# EAGLE design wiggle_jig (EAGLE 6.6.0)
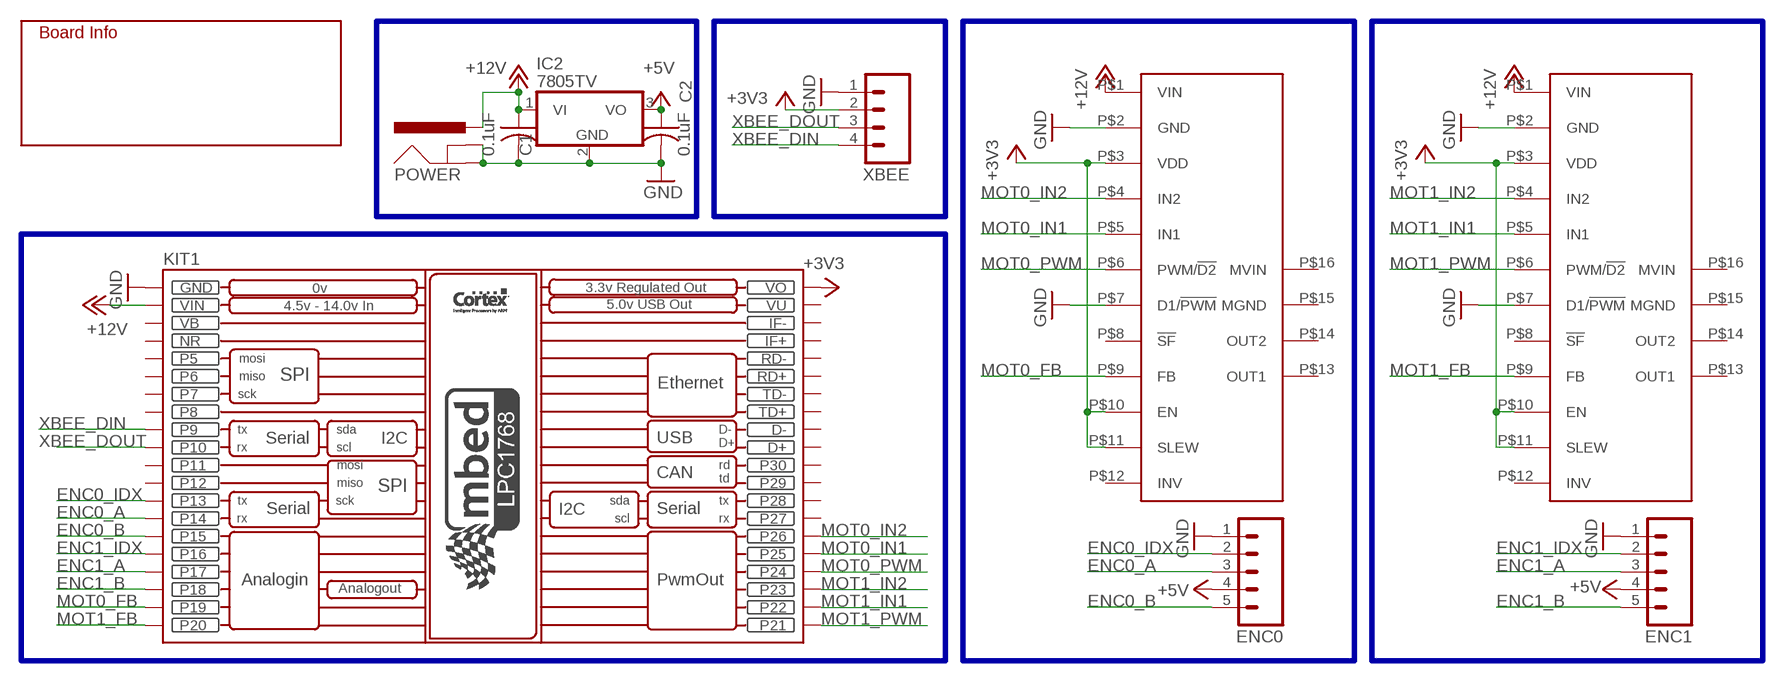
[diagram p0: schematic, sheet 1]

## Parts
C1  0.1uF  C-US025-025X050  [C025-025X050]
C2  0.1uF  C-US025-025X050  [C025-025X050]
ENC0  M05LOCK  [1X05_LOCK]
ENC1  M05LOCK  [1X05_LOCK]
IC2  7805TV  [TO220V]
KIT1  MBED_NXP_LPC1768  [MBED-KIT]
MOT0  MC33926_CARRIER  [MC33926_CARRIER]
MOT1  MC33926_CARRIER  [MC33926_CARRIER]
POWER  POWER_JACKPTH_LOCK  [POWER_JACK_PTH_LOCK]
U$4  INFO  [INFO]
XBEE  M04LOCK  [1X04_LOCK]

## Nets
+3V3: KIT1.VOUT(VO) MOT0.P$3(VDD) MOT0.P$10(EN) MOT0.P$11(SLEW) MOT1.P$3(VDD) MOT1.P$10(EN) MOT1.P$11(SLEW) XBEE.2
+5V: C2.1 ENC0.4 ENC1.4 IC2.3(VO)
+12V: C1.1 IC2.1(VI) KIT1.VIN MOT0.P$1(VIN) MOT1.P$1(VIN) POWER.PWR
ENC0_A: ENC0.3 KIT1.P$14(P14)
ENC0_B: ENC0.5 KIT1.P$15(P15)
ENC0_IDX: ENC0.2 KIT1.P$13(P13)
ENC1_A: ENC1.3 KIT1.P$17(P17)
ENC1_B: ENC1.5 KIT1.P$18(P18)
ENC1_IDX: ENC1.2 KIT1.P$16(P16)
GND: C1.2 C2.2 ENC0.1 ENC1.1 IC2.2(GND) KIT1.GND MOT0.P$2(GND) MOT0.P$7(D1/!PWM) MOT1.P$2(GND) MOT1.P$7(D1/!PWM) POWER.GND POWER.GNDBREAK XBEE.1
MOT0_FB: KIT1.P$19(P19) MOT0.P$9(FB)
MOT0_IN1: KIT1.P$25(P25) MOT0.P$5(IN1)
MOT0_IN2: KIT1.P$26(P26) MOT0.P$4(IN2)
MOT0_PWM: KIT1.P$24(P24) MOT0.P$6(PWM/!D2)
MOT1_FB: KIT1.P$20(P20) MOT1.P$9(FB)
MOT1_IN1: KIT1.P$22(P22) MOT1.P$5(IN1)
MOT1_IN2: KIT1.P$23(P23) MOT1.P$4(IN2)
MOT1_PWM: KIT1.P$21(P21) MOT1.P$6(PWM/!D2)
XBEE_DIN: KIT1.P$9(P9) XBEE.4
XBEE_DOUT: KIT1.P$10(P10) XBEE.3
Unconnected: KIT1.D+ KIT1.D- KIT1.IF+ KIT1.IF- KIT1.P$5(P5) KIT1.P$6(P6) KIT1.P$7(P7) KIT1.P$8(P8) KIT1.P$11(P11) KIT1.P$12(P12) KIT1.P$27(P27) KIT1.P$28(P28) KIT1.P$29(P29) KIT1.P$30(P30) KIT1.RD+ KIT1.RD- KIT1.TD+ KIT1.TD- MOT0.P$8(!SF) MOT0.P$12(INV) MOT0.P$13(OUT1) MOT0.P$14(OUT2) MOT0.P$15(MGND) MOT0.P$16(MVIN) MOT1.P$8(!SF) MOT1.P$12(INV) MOT1.P$13(OUT1) MOT1.P$14(OUT2) MOT1.P$15(MGND) MOT1.P$16(MVIN)

## Buses
B$1
B$2
B$3
B$4
B$5

## Power pins joined to a net without a drawn wire
NR: KIT1.NR
VB: KIT1.VB
VU: KIT1.VU

## Library data of the parts
C1 C2 = rcl:C-US: CAPACITOR, American symbol
ENC0 ENC1 = SparkFun-Connectors:M05: Header 5 Standard 5-pin 0.1" header. Use with straight break away headers (SKU : PRT-00116), right angle break away headers (PRT-00553), swiss pins (PRT-00743), machine pins (PRT-00117), and female headers (PRT-00115). Molex polarized connector foot print use with SKU : PRT-08230 with associated crimp pins and housings.
IC2 = linear:78*: Positive VOLTAGE REGULATOR Source: http://cache.national.com/ds/LM/LM78L05.pdf http://www.fairchildsemi.com/ds/LM/LM7805.pdf
KIT1 = zumy:MBED_NXP_LPC1768: Mbed LPC1768 - ARM CORTEX v2.1 * Schematic symbol is now placed in eagles's default raster. *The pads diameter are suitable for routing between mbed pins * mbed pads are 0.8 mm drill diameter. --------------------------------------------- Created by: Mohamed Yousry *Alexandria, Egypt *Email: mohamed.yousry@ieeegoldegypt.org
MOT0 MOT1 = arm:MC33926_CARRIER
POWER = SparkFun-Connectors:POWER_JACK: Power Jack This is the standard 5.5mm barrel jack for power. The PTH is the most common, proven, reliable, footprint. The Slot footprint only works if the mill layer is transmitted to the PCB fab house so be warned. Mating wall wart : TOL-00298 (and others); PROD_ID: PRT-00119
U$4 = modular_robotics:INFO; AUTHOR: A. Buchan; DATE: Oct. 19, 2016; DESIGN: WiggleJig; ORGANIZATION: Biomimetic Millisystems Lab; REVISION: r0.0
XBEE = SparkFun-Connectors:M04: Header 4 Standard 4-pin 0.1" header. Use with straight break away headers (SKU : PRT-00116), right angle break away headers (PRT-00553), swiss pins (PRT-00743), machine pins (PRT-00117), and female headers (PRT-00115). Molex polarized connector foot print use with SKU : PRT-08231 with associated crimp pins and housings. 1MM SMD Version SKU: PRT-10208

## Board
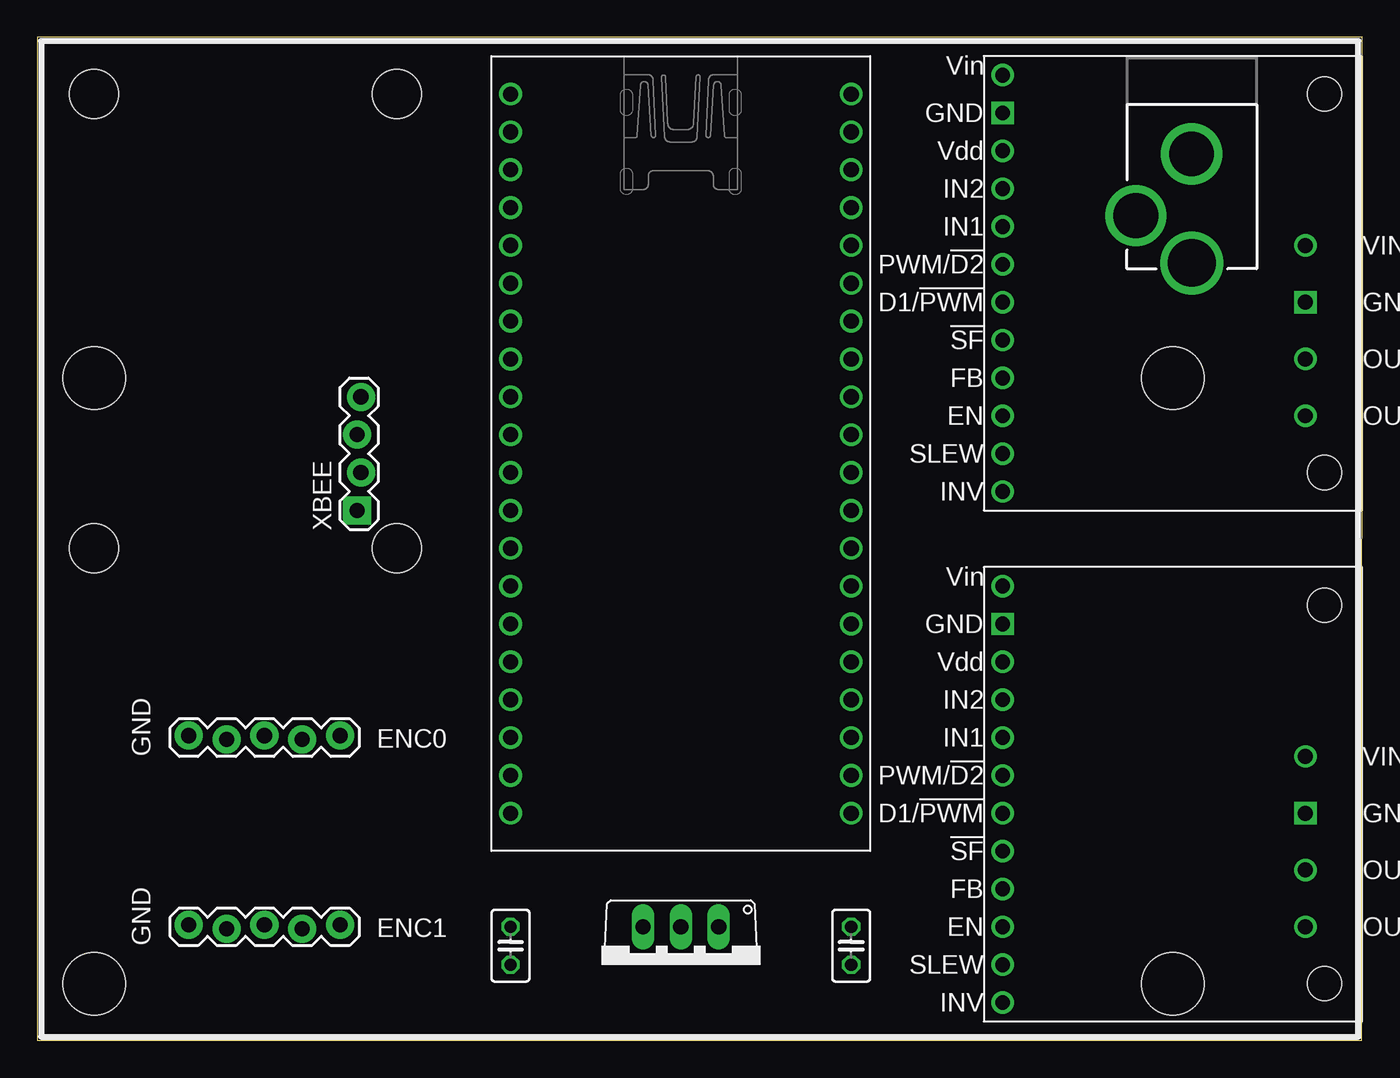
[diagram p1: board, top side]
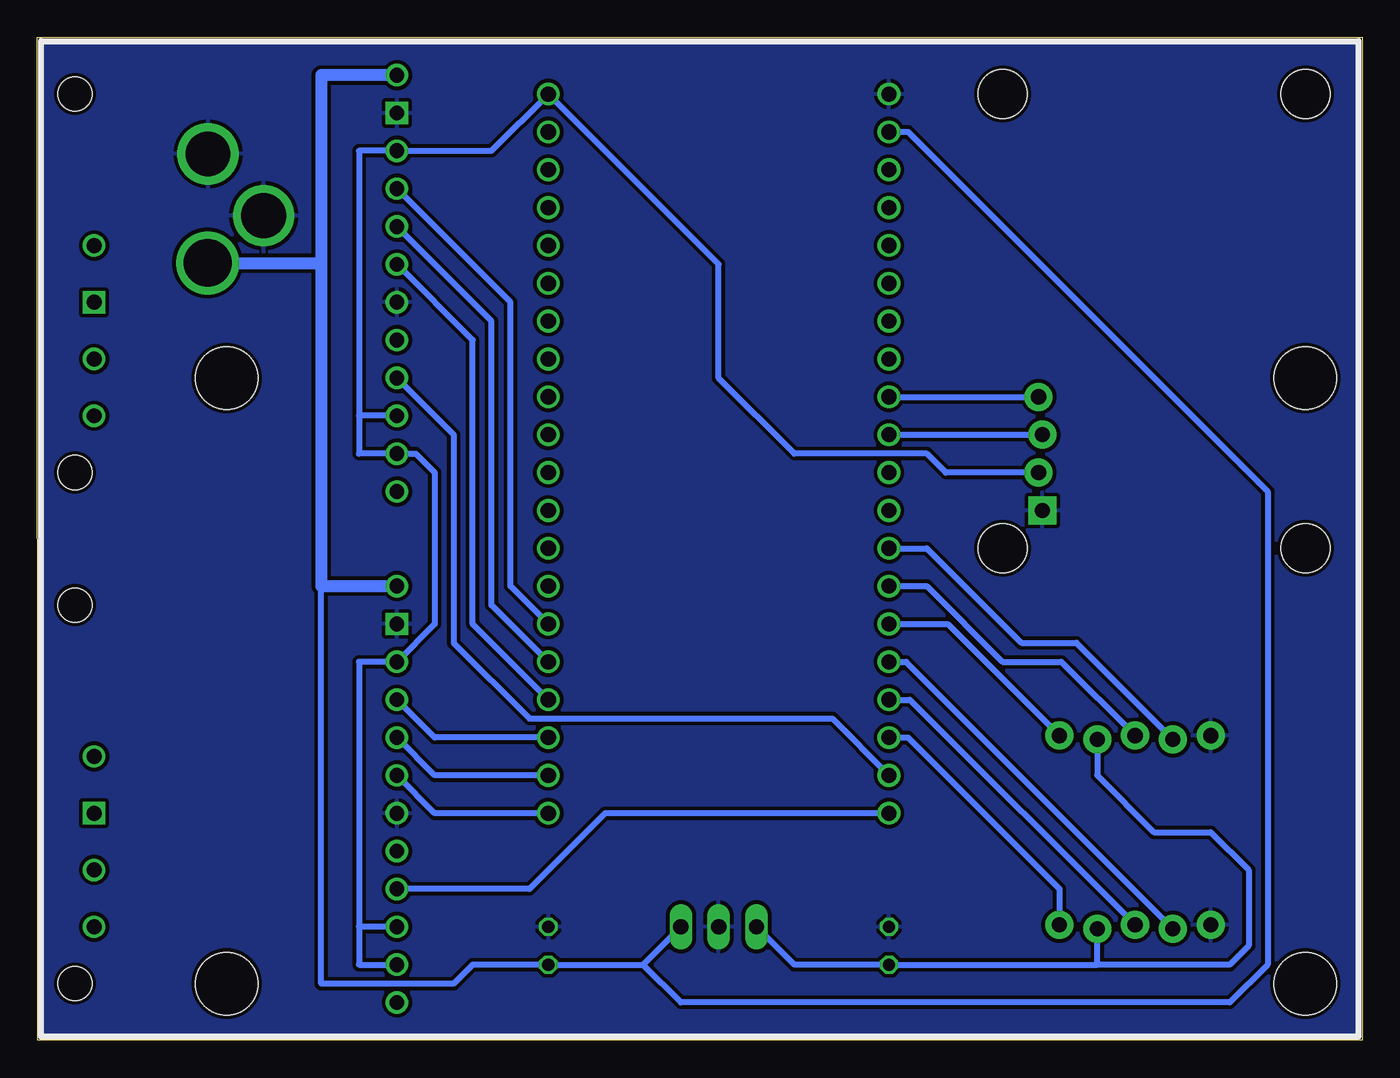
[diagram p2: board, bottom side, seen from below]

Size 88.9 x 67.31 mm. Coordinates in mm from the lower left corner, seen from the top.
Outline: 0,0 88.88,0 88.9,67.31 0,67.31 0,0
Copper layers (1*16): Top 0.035mm / dielectric 1.5mm / Bottom 0.035mm
Design rules "bay_area_circuits *": minimum track width 5mil, minimum drill 10mil, track to track 5mil, track to pad 5mil, pad to pad 5mil, via to via 5mil, smd to smd 5mil, copper to edge 10mil, drill to drill 10mil, minimum pad ring 5mil, minimum via ring 5mil, stop-mask expansion 4mil, vias tented up to drill 5mil, thermal gap 10mil
Holes 4.19 mm at 3.81,3.81 76.2,44.45 76.2,3.81 3.81,44.45

### Footprints (pad centres in the part's own frame; a part is rotated, then mirrored left to right if it is on the bottom)
C025-025X050 = drill 0.813 octagon: 1 -1.27,0; 2 1.27,0
1X05_LOCK = drill 1.016 pad 1.88: 1 0,0.127; 2 2.54,-0.127; 3 5.08,0.127; 4 7.62,-0.127; 5 10.16,0.127
TO220V = drill 1.016 long: 1 -2.54,-2.54; 2 0,-2.54; 3 2.54,-2.54
MBED-KIT = drill 1.016: D+ 11.43,1.27; D- 11.43,3.81; GND -11.43,24.13; IF+ 11.43,16.51; IF- 11.43,19.05; NR -11.43,16.51; P$5 -11.43,13.97; P$6 -11.43,11.43; P$7 -11.43,8.89; P$8 -11.43,6.35; P$9 -11.43,3.81; P$10 -11.43,1.27; P$11 -11.43,-1.27; P$12 -11.43,-3.81; P$13 -11.43,-6.35; P$14 -11.43,-8.89; P$15 -11.43,-11.43; P$16 -11.43,-13.97; P$17 -11.43,-16.51; P$18 -11.43,-19.05; P$19 -11.43,-21.59; P$20 -11.43,-24.13; P$21 11.43,-24.13; P$22 11.43,-21.59; P$23 11.43,-19.05; P$24 11.43,-16.51; P$25 11.43,-13.97; P$26 11.43,-11.43; P$27 11.43,-8.89; P$28 11.43,-6.35; P$29 11.43,-3.81; P$30 11.43,-1.27; RD+ 11.43,11.43; RD- 11.43,13.97; TD+ 11.43,6.35; TD- 11.43,8.89; VB -11.43,19.05; VIN -11.43,21.59; VOUT 11.43,24.13; VU 11.43,21.59
MC33926_CARRIER = drill 1: P$1 -11.43,13.97; P$3 -11.43,8.89; P$4 -11.43,6.35; P$5 -11.43,3.81; P$6 -11.43,1.27; P$7 -11.43,-1.27; P$8 -11.43,-3.81; P$9 -11.43,-6.35; P$10 -11.43,-8.89; P$11 -11.43,-11.43; P$12 -11.43,-13.97; P$13 8.89,-8.89; P$14 8.89,-5.08; P$16 8.89,2.54 | drill 1 square: P$2 -11.43,11.43; P$15 8.89,-1.27 | hole 2.286: 10.16,12.7; 10.16,-12.7
POWER_JACK_PTH_LOCK = drill 2.997 pad 4.115: GND 0.025,6.557; GNDBREAK 3.762,10.7 | drill 3.2 pad 4.115: PWR 0,13.878
STAND-OFF = hole 3.302: 0,0
1X04_LOCK = drill 1.016 pad 1.88 square: 1 0,0.127 | drill 1.016 pad 1.88: 2 2.54,-0.127; 3 5.08,0.127; 4 7.62,-0.127

### Placement (x,y rotation side)
C1  54.61,6.35 90 top
C2  31.75,6.35 90 top
ENC0  10.16,20.32 0 top
ENC1  10.16,7.62 0 top
IC2  43.18,5.08 180 top
KIT1  43.18,39.37 0 top
MOT0  76.2,50.8 0 top
MOT1  76.2,16.51 0 top
POWER  77.47,66.04 180 top
U$1  STAND-OFF  [STAND-OFF]  24.13,63.5 180 top
U$2  STAND-OFF  [STAND-OFF]  3.81,33.02 180 top
U$3  STAND-OFF  [STAND-OFF]  3.81,63.5 180 top
U$4  8.89,11.43 0 top
U$9  STAND-OFF  [STAND-OFF]  24.13,33.02 180 top
XBEE  21.59,35.56 90 top

### Tracks (layer width: path | path; a pad name or v marks a point on that pad's centre or on a via)
+3V3
  Bottom 0.406: 67.31,41.91 67.31,59.69 MOT0.P$3 58.42,59.69 KIT1.VOUT 43.18,52.07 43.18,44.45 38.1,39.37 29.21,39.37 27.94,38.1 XBEE.2 | 67.31,41.91 67.31,39.37 MOT0.P$11 63.5,39.37 62.23,38.1 62.23,27.94 MOT1.P$3 67.31,25.4 67.31,7.62 | 67.31,7.62 67.31,5.08 MOT1.P$11 | MOT1.P$10 67.31,7.62 | MOT0.P$10 67.31,41.91
+5V
  Bottom 0.406: 17.78,5.08 8.89,5.08 7.62,6.35 7.62,11.43 10.16,13.97 13.97,13.97 17.78,17.78 ENC0.4 | 17.78,5.08 ENC1.4 | 17.78,5.08 C2.1 38.1,5.08 IC2.3
+12V
  Bottom 0.406: 48.26,5.08 C1.1 59.69,5.08 60.96,3.81 69.85,3.81 69.85,30.48 | 48.26,5.08 IC2.1 | KIT1.VIN 30.48,60.96 6.35,36.83 6.35,5.08 8.89,2.54 45.72,2.54 48.26,5.08
  Bottom 0.813: MOT0.P$1 69.85,64.77 69.85,52.07 | 69.85,52.07 69.85,30.48 MOT1.P$1 | POWER.PWR 69.94,52.16 69.85,52.07
ENC0_A
  Bottom 0.406: KIT1.P$14 29.21,30.48 24.13,25.4 20.19,25.4 ENC0.3
ENC0_B
  Bottom 0.406: KIT1.P$15 27.81,27.94 ENC0.5
ENC0_IDX
  Bottom 0.406: KIT1.P$13 29.21,33.02 22.86,26.67 19.18,26.67 ENC0.2
ENC1_A
  Bottom 0.406: KIT1.P$17 30.35,22.86 ENC1.3
ENC1_B
  Bottom 0.406: KIT1.P$18 30.48,20.32 20.32,10.16 ENC1.5
ENC1_IDX
  Bottom 0.406: KIT1.P$16 30.61,25.4 ENC1.2
GND
  pour Bottom (isolate 0.254): 0,0 88.9,0 88.9,67.31 0,67.31
MOT0_FB
  Bottom 0.406: MOT0.P$9 60.96,40.64 60.96,26.67 55.88,21.59 35.56,21.59 KIT1.P$19
MOT0_IN1
  Bottom 0.406: KIT1.P$25 58.42,29.21 58.42,48.26 MOT0.P$5
MOT0_IN2
  Bottom 0.406: KIT1.P$26 57.15,30.48 57.15,49.53 MOT0.P$4
MOT0_PWM
  Bottom 0.406: KIT1.P$24 59.69,27.94 59.69,46.99 MOT0.P$6
MOT1_FB
  Bottom 0.406: KIT1.P$20 50.8,15.24 55.88,10.16 MOT1.P$9
MOT1_IN1
  Bottom 0.406: KIT1.P$22 62.23,17.78 MOT1.P$5
MOT1_IN2
  Bottom 0.406: KIT1.P$23 62.23,20.32 MOT1.P$4
MOT1_PWM
  Bottom 0.406: KIT1.P$21 62.23,15.24 MOT1.P$6
XBEE_DIN
  Bottom 0.406: KIT1.P$9 XBEE.4
XBEE_DOUT
  Bottom 0.406: KIT1.P$10 XBEE.3

### Text on the board
tPlace: GND | GND